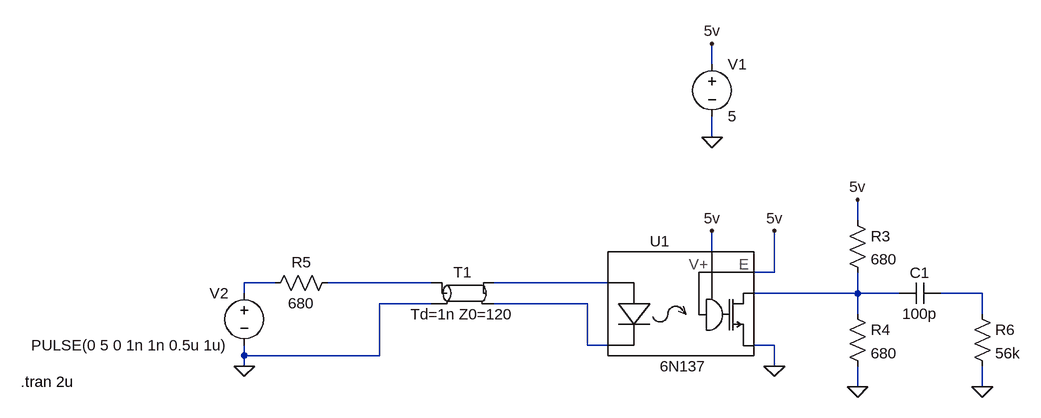
[diagram p0: schematic clock_distribution.asc]
clock_distribution.asc, the LTspice schematic file:
Version 4
SHEET 1 880 680
WIRE 240 -192 240 -224
WIRE 240 -80 240 -112
WIRE 464 48 464 16
WIRE 240 96 240 64
WIRE 336 128 336 64
WIRE 336 128 304 128
WIRE -432 144 -480 144
WIRE -192 144 -352 144
WIRE 80 144 -96 144
WIRE -480 160 -480 144
WIRE 464 160 464 128
WIRE 464 160 304 160
WIRE 528 160 464 160
WIRE 656 160 592 160
WIRE -192 176 -272 176
WIRE 48 176 -96 176
WIRE 464 192 464 160
WIRE 656 192 656 160
WIRE 48 240 48 176
WIRE 80 240 48 240
WIRE 336 240 304 240
WIRE -480 256 -480 240
WIRE -272 256 -272 176
WIRE -272 256 -480 256
WIRE -480 272 -480 256
WIRE 336 272 336 240
WIRE 464 304 464 272
WIRE 656 304 656 272
FLAG 240 -80 0
FLAG 240 -224 5v
FLAG 240 64 5v
FLAG 336 272 0
FLAG 464 304 0
FLAG -480 272 0
FLAG 656 304 0
FLAG 336 64 5v
FLAG 464 16 5v
SYMBOL 6N137 176 192 R0
SYMATTR InstName U1
SYMBOL voltage 240 -208 R0
SYMATTR InstName V1
SYMATTR Value 5
SYMBOL res 448 32 R0
SYMATTR InstName R3
SYMATTR Value 680
SYMBOL res 448 176 R0
SYMATTR InstName R4
SYMATTR Value 680
SYMBOL voltage -480 144 M0
WINDOW 123 0 0 Left 0
WINDOW 39 0 0 Left 0
SYMATTR InstName V2
SYMATTR Value PULSE(0 5 0 1n 1n 0.5u 1u)
SYMBOL res -336 128 R90
WINDOW 0 0 56 VBottom 2
WINDOW 3 32 56 VTop 2
SYMATTR InstName R5
SYMATTR Value 680
SYMBOL cap 592 144 R90
WINDOW 0 0 32 VBottom 2
WINDOW 3 32 32 VTop 2
SYMATTR InstName C1
SYMATTR Value 100p
SYMBOL res 640 176 R0
SYMATTR InstName R6
SYMATTR Value 56k
SYMBOL tline -144 160 R0
SYMATTR InstName T1
SYMATTR Value Td=1n Z0=120
TEXT -824 296 Left 2 !.tran 2u

The netlist it stands for:
* clock_distribution.asc
XU1 N003 N006 0 N004 5v 5v 6N137  ; pins A K S C V E
V1 5v 0 5
R3 5v N004 680
R4 N004 0 680
V2 N001 0 PULSE(0 5 0 1n 1n 0.5u 1u)
R5 N002 N001 680
C1 N005 N004 100p
R6 N005 0 56k
T1 N002 0 N003 N006 Td=1n Z0=120
.tran 2u
.lib 6N137.SUB
.backanno
.end